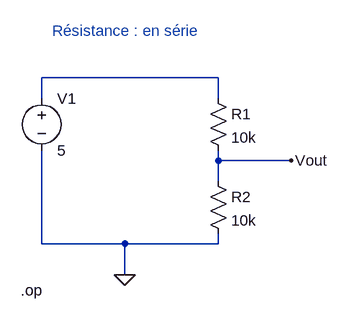
[diagram p0: schematic 02_Resistance_Serie.asc]
02_Resistance_Serie.asc, the LTspice schematic file:
Version 4.1
SHEET 1 1068 680
WIRE 240 80 -32 80
WIRE -32 112 -32 80
WIRE 240 112 240 80
WIRE 240 208 240 192
WIRE 352 208 240 208
WIRE 240 240 240 208
WIRE -32 336 -32 192
WIRE 96 336 -32 336
WIRE 240 336 240 320
WIRE 240 336 96 336
WIRE 96 384 96 336
FLAG 96 384 0
FLAG 352 208 Vout
SYMBOL voltage -32 96 R0
WINDOW 123 0 0 Left 0
WINDOW 39 0 0 Left 0
SYMATTR InstName V1
SYMATTR Value 5
SYMBOL res 224 96 R0
SYMATTR InstName R1
SYMATTR Value 10k
SYMBOL res 224 224 R0
SYMATTR InstName R2
SYMATTR Value 10k
TEXT -16 8 Left 2 ;Résistance : en série
TEXT -64 408 Left 2 !.op

The netlist it stands for:
* 02_Resistance_Serie.asc
V1 N001 0 5
R1 N001 Vout 10k
R2 Vout 0 10k
* Résistance : en série
.op
.backanno
.end